# Altium schematic sheet Sheet1.SchDoc
size A; SheetNumber: 1; SheetTotal: 6
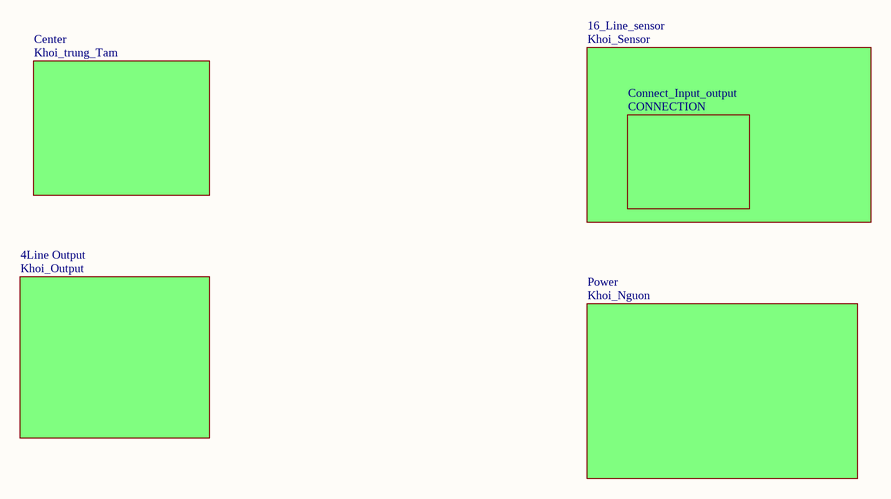
[diagram p0: Sheet1.SchDoc]

## Sub-sheets
4Line Output = Khoi_Output: no entries
16_Line_sensor = Khoi_Sensor: no entries
Center = Khoi_trung_Tam: no entries
Connect_Input_output = CONNECTION: no entries
Power = Khoi_Nguon: no entries